# Altium schematic sheet PCIe_JTAG.SchDoc: Grandmaster PCIe & JTAG Connectors
size Tabloid; Author: N Smith; Revision: A; SheetNumber: 3; SheetTotal: 7; Customer: 01910
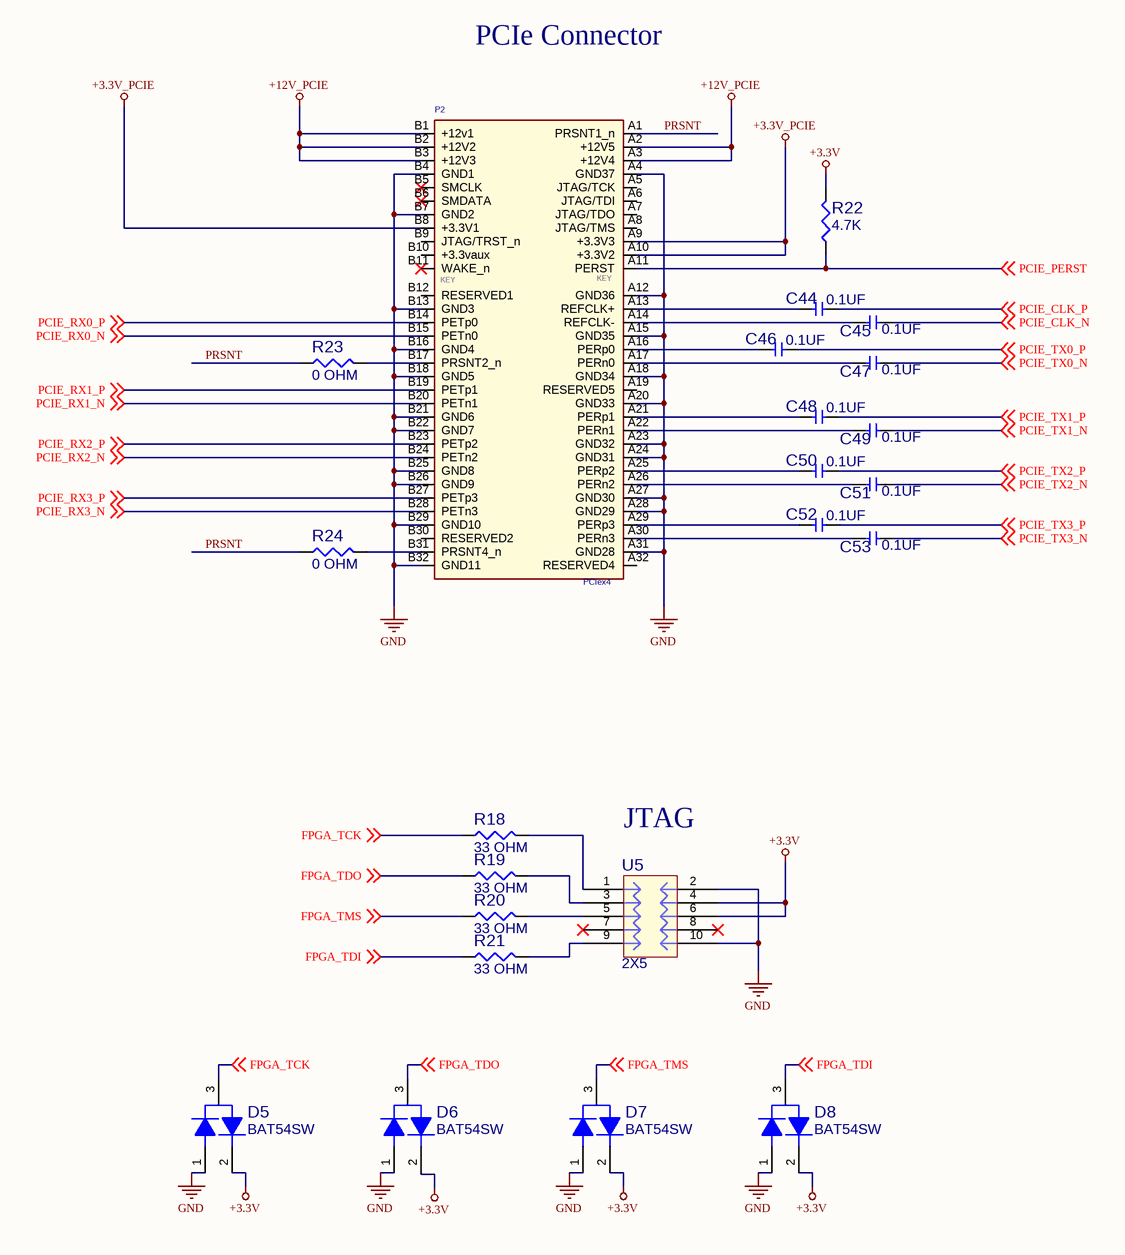
[diagram p0: PCIe_JTAG.SchDoc]

## Parts
C44  value 0.1UF  [CAPC1005X06N]  (hidden comment: CAP_0402_0.1UF_50V)
C45  value 0.1UF  [CAPC1005X06N]  (hidden comment: CAP_0402_0.1UF_50V)
C46  value 0.1UF  [CAPC1005X06N]  (hidden comment: CAP_0402_0.1UF_50V)
C47  value 0.1UF  [CAPC1005X06N]  (hidden comment: CAP_0402_0.1UF_50V)
C48  value 0.1UF  [CAPC1005X06N]  (hidden comment: CAP_0402_0.1UF_50V)
C49  value 0.1UF  [CAPC1005X06N]  (hidden comment: CAP_0402_0.1UF_50V)
C50  value 0.1UF  [CAPC1005X06N]  (hidden comment: CAP_0402_0.1UF_50V)
C51  value 0.1UF  [CAPC1005X06N]  (hidden comment: CAP_0402_0.1UF_50V)
C52  value 0.1UF  [CAPC1005X06N]  (hidden comment: CAP_0402_0.1UF_50V)
C53  value 0.1UF  [CAPC1005X06N]  (hidden comment: CAP_0402_0.1UF_50V)
D5  BAT54SW  [SOT65P210X110-3N]
D6  BAT54SW  [SOT65P210X110-3N]
D7  BAT54SW  [SOT65P210X110-3N]
D8  BAT54SW  [SOT65P210X110-3N]
P2  PCIex4  [PCIE_4LANE_EDGE]
R18  value 33 OHM  [RESC2012X50N]  (hidden comment: CRCW080533R0FKEA)
R19  value 33 OHM  [RESC2012X50N]  (hidden comment: CRCW080533R0FKEA)
R20  value 33 OHM  [RESC2012X50N]  (hidden comment: CRCW080533R0FKEA)
R21  value 33 OHM  [RESC2012X50N]  (hidden comment: CRCW080533R0FKEA)
R22  value 4.7K  [RESC1608X50N]  (hidden comment: ERJ-3EKF4701V)
R23  value 0 OHM  [RESC1005X04N]  (hidden comment: ERJ-2GE0R00X)
R24  value 0 OHM  [RESC1005X04N]  (hidden comment: ERJ-2GE0R00X)
U5  value 2X5  [SAMTEC_HTST-105-01-L-DV-A]  (hidden comment: HTST-105-01-L-DV-A)

## Nets
+3.3V: D5.2 D6.2 D7.2 D8.2 R22.2 U5.4(P4) U5.6(P6)
+3.3V_PCIE: P2.A9(+3.3V3) P2.A10(+3.3V2) P2.B8(+3.3V1)
+12V_PCIE: P2.A2(+12V5) P2.A3(+12V4) P2.B1(+12v1) P2.B2(+12V2) P2.B3(+12V3)
GND: D5.1 D6.1 D7.1 D8.1 P2.A4(GND37) P2.A12(GND36) P2.A15(GND35) P2.A18(GND34) P2.A20(GND33) P2.A23(GND32) P2.A24(GND31) P2.A27(GND30) P2.A28(GND29) P2.A31(GND28) P2.B4(GND1) P2.B7(GND2) P2.B13(GND3) P2.B16(GND4) P2.B18(GND5) P2.B21(GND6) P2.B22(GND7) P2.B25(GND8) P2.B26(GND9) P2.B29(GND10) P2.B32(GND11) U5.2(P2) U5.10(P10)
FPGA_TCK: D5.3 R18.1 ; off-sheet FPGA_TCK
FPGA_TDI: D8.3 R21.1 ; off-sheet FPGA_TDI
FPGA_TDO: D6.3 R19.1 ; off-sheet FPGA_TDO
FPGA_TMS: D7.3 R20.1 ; off-sheet FPGA_TMS
PCIE_CLK_N: C45.2 ; off-sheet PCIE_CLK_N
PCIE_CLK_P: C44.2 ; off-sheet PCIE_CLK_P
PCIE_PERST: P2.A11(PERST) R22.1 ; off-sheet PCIE_PERST
PCIE_RX0_N: P2.B15(PETn0) ; off-sheet PCIE_RX0_N
PCIE_RX0_P: P2.B14(PETp0) ; off-sheet PCIE_RX0_P
PCIE_RX1_N: P2.B20(PETn1) ; off-sheet PCIE_RX1_N
PCIE_RX1_P: P2.B19(PETp1) ; off-sheet PCIE_RX1_P
PCIE_RX2_N: P2.B24(PETn2) ; off-sheet PCIE_RX2_N
PCIE_RX2_P: P2.B23(PETp2) ; off-sheet PCIE_RX2_P
PCIE_RX3_N: P2.B28(PETn3) ; off-sheet PCIE_RX3_N
PCIE_RX3_P: P2.B27(PETp3) ; off-sheet PCIE_RX3_P
PCIE_TX0_N: C47.2 ; off-sheet PCIE_TX0_N
PCIE_TX0_P: C46.2 ; off-sheet PCIE_TX0_P
PCIE_TX1_N: C49.2 ; off-sheet PCIE_TX1_N
PCIE_TX1_P: C48.2 ; off-sheet PCIE_TX1_P
PCIE_TX2_N: C51.2 ; off-sheet PCIE_TX2_N
PCIE_TX2_P: C50.2 ; off-sheet PCIE_TX2_P
PCIE_TX3_N: C53.2 ; off-sheet PCIE_TX3_N
PCIE_TX3_P: C52.2 ; off-sheet PCIE_TX3_P
PRSNT: P2.A1(PRSNT1_n) R23.1 R24.1
NetC44_1: C44.1 P2.A13(REFCLK+)
NetC45_1: C45.1 P2.A14(REFCLK-)
NetC46_1: C46.1 P2.A16(PERp0)
NetC47_1: C47.1 P2.A17(PERn0)
NetC48_1: C48.1 P2.A21(PERp1)
NetC49_1: C49.1 P2.A22(PERn1)
NetC50_1: C50.1 P2.A25(PERp2)
NetC51_1: C51.1 P2.A26(PERn2)
NetC52_1: C52.1 P2.A29(PERp3)
NetC53_1: C53.1 P2.A30(PERn3)
NetP2_B17: P2.B17(PRSNT2_n) R23.2
NetP2_B31: P2.B31(PRSNT4_n) R24.2
NetR18_2: R18.2 U5.1(P1)
NetR19_2: R19.2 U5.3(P3)
NetR20_2: R20.2 U5.5(P5)
NetR21_2: R21.2 U5.9(P9)

Not connected (* = marked no-connect by the designer): P2 A5(JTAG/TCK) A6(JTAG/TDI) A7(JTAG/TDO) A8(JTAG/TMS) A19(RESERVED5) A32(RESERVED4) B5(SMCLK)* B6(SMDATA)* B9(JTAG/TRST_n) B10(+3.3vaux) B11(WAKE_n)* B12(RESERVED1) B30(RESERVED2); U5 7(P7)* 8(P8)*

## Notes on the sheet
- PCIe Connector
- JTAG
- SHEET
- timingcard.com <http://timingcard.com>
- OF
- (in symbol PCIex4) KEY

## Library data of the parts
C44-C53 = CAP_0402_0.1UF_50V: CAP, CER, 0.1UF, 50V, 10%, X7R, AEC-Q200, 0402; MFG PART NUM: CGA2B3X7R1H104K050BB; VALENTIUM PART NUM: <VALENTIUM>; MFG NAME: TDK; MAXTEMP: 125C; MINTEMP: -55C; CATEGORY: CAP, CER; MODIFY DATE: 10/23/2013; SHEETPART: *; P1: 10%; OTHER: AEC-Q200; P2: 50V; P3: X7R; Size: 0402; DESC: CAP, CER, 0.1UF, 50V, 10%, X7R, AEC-Q200, 0402; Supplier 1: Digi-Key; Supplier Part Number 1: 445-6899-1-ND
D5-D8 = BAT54SW: DIO, SCHOTTKY, BAT54S, DUAL SERIES, 30V, 200MA, SC-70; MFG PART NUM: BAT54SWQ-7-F; VALENTIUM PART NUM: <VALENTIUM>; MFG NAME: DIODES INC; MAXTEMP: 150C; MINTEMP: -55C; P3: 200mA,200mW; MODIFY DATE: 9/4/2013; CATEGORY: DIO, SCHOTTKY; OTHER: SERIES; P1: SCHOTTKY; P2: 30V; SIZE: SC-70; SHEETPART: *; DESC: DIO, SCHOTTKY, BAT54S, DUAL SERIES, 30V, 200MA, SC-70; Supplier 1: Digi-Key; Supplier Part Number 1: BAT54SWQ-7-FDICT-ND; VALUE: BAT54SW
P2 = PCIex4: PCIE x4 Edge Connector,OrCAD Symbol,NC; Part Number: 451; Manufacturer: NA; NOTE: NC; Vendor P/N: NA; Part Type: SMT
R18-R21 = RES_0805_33: RES, 33 OHM, 1%, 1/8W, TF, 0805; VELENTIUM PART NUM: <VELENTIUM>; MFG NAME: VISHAY/DALE; MAXTEMP: 125C; MINTEMP: -55C; OTHER: 100PPM; MFG PART NUM: CRCW080533R0FKEA; CATEGORY: RES; ModifyDate: 7/26/2013; P1: 1%; P3: TF; P2: 1/8W; SIZE: 0805; Supplier 1: Digi-Key; Supplier Part Number 1: 541-33.0CCT-ND; SHEETPART: *; DESC: RES, 33 OHM, 1%, 1/8W, TF, 0805
R22 = RES_0603_4.7K: RES, 4.7K, 1%, 1/10W, TF, 0603; VELENTIUM PART NUM: <VELENTIUM>; MFG NAME: PANASONIC; MAXTEMP: 125C; MINTEMP: -55C; OTHER: 100PPM; SUB: GENERIC; ModifyDate: 7/25/2013; MFG PART NUM: ERJ-3EKF4701V; CATEGORY: RES; Date: 7/26/2013; P1: 1%; P3: TF; P2: 1/10W; SIZE: 0603; Supplier 1: Digi-Key; Supplier Part Number 1: P4.70KHCT-ND; SHEETPART: *; DESC: RES, 4.7K, 1%, 1/10W, TF, 0603
R23 R24 = RES_0402_0: RES, 0. OHM, 1%, 1/16W, TF, AEC-Q200, 0402; VELENTIUM PART NUM: <VELENTIUM>; MFG NAME: PANASONIC; MAXTEMP: 155C; MINTEMP: -55C; OTHER: 100PPM, AEC-Q200; SUB: GENERIC; DESC: RES, 0 OHM, 1%, 1/16W, TF, AEC-Q200, 0402; ModifyDate: 7/25/2013; MFG PART NUM: ERJ-2GE0R00X; CATEGORY: RES; Date: 7/26/2013; P1: 1%; P3: TF; P2: 1/16W; SIZE: 0402; SHEETPART: *; Supplier 1: Digi-Key; Supplier Part Number 1: P0.0JCT-ND
U5 = SAMTEC-HTSH-105-01-L-DV: CONN, HDR, 2X5, VERT, 0.1IN  SHROUDED, SMT, HTSH SERIES; VALENTIUM PART NUM: <VALENTIUM>; MFG NAME: SAMTEC INC; MAXTEMP: 125C; MINTEMP: -55C; MFG PART NUM: HTST-105-01-L-DV-A; MODIFY DATE: 10/10/2013; CATEGORY: CONN, HDR; OTHER: HTSH SERIES; P1: VERT; P2: 0.1 IN; P3: SHROUDED; SIZE: SMT; DESC: CONN, HDR, 2X5, VERT, 0.1IN  SHROUDED, SMT, HTSH SERIES; Supplier 1: Digi-Key; Supplier Part Number 1: SAM8809-ND